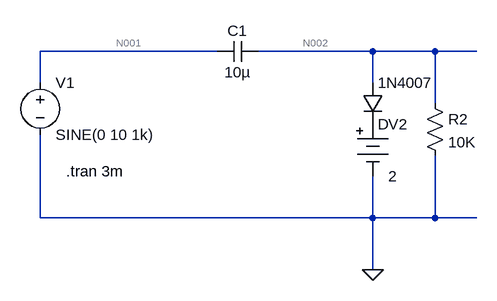
[diagram p0: schematic Obj4.3.asc]
Obj4.3.asc, the LTspice schematic file:
Version 4
SHEET 1 880 680
WIRE 32 64 -240 64
WIRE 272 64 96 64
WIRE 368 64 272 64
WIRE 432 64 368 64
WIRE -240 112 -240 64
WIRE 272 112 272 64
WIRE 368 144 368 64
WIRE -240 320 -240 192
WIRE 272 320 272 256
WIRE 272 320 -240 320
WIRE 368 320 368 224
WIRE 368 320 272 320
WIRE 432 320 368 320
WIRE 272 400 272 320
FLAG 272 400 0
SYMBOL diode 256 112 R0
SYMATTR InstName 1N4007
SYMBOL voltage -240 96 R0
WINDOW 123 0 0 Left 0
WINDOW 39 0 0 Left 0
SYMATTR InstName V1
SYMATTR Value SINE(0 10 1k)
SYMBOL res 352 128 R0
SYMATTR InstName R2
SYMATTR Value 10K
SYMBOL Misc\\battery 272 160 R0
WINDOW 123 0 0 Left 0
WINDOW 39 0 0 Left 0
SYMATTR InstName V2
SYMATTR Value 2
SYMBOL cap 96 48 R90
WINDOW 0 0 32 VBottom 2
WINDOW 3 32 32 VTop 2
SYMATTR InstName C1
SYMATTR Value 10µ
TEXT -200 248 Left 2 !.tran 3m

The netlist it stands for:
* Obj4.3.asc
D§1N4007 N002 P001 D
V1 N001 0 SINE(0 10 1k)
R2 N002 0 10K
V2 P001 0 2
C1 N002 N001 10µ
.model D D
.lib standard.dio
.tran 3m
.backanno
.end

* Results of the author's LTspice run, read from the files saved beside the schematic
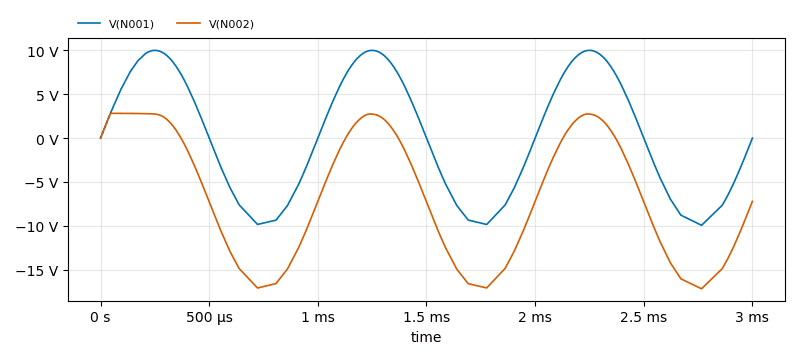
[diagram p1: Transient Analysis of Obj4.3.asc, plotted from the saved traces]
* Transient Analysis, 1 run:
*   V(N001): min -9.943 V, max 10 V, average 49.81 mV, rms 7.028 V, last 0 V
*   V(N002): min -17.18 V, max 2.821 V, average -6.91 V, rms 10.04 V, last -7.21 V